# EAGLE design Bread (EAGLE 7.2.0)
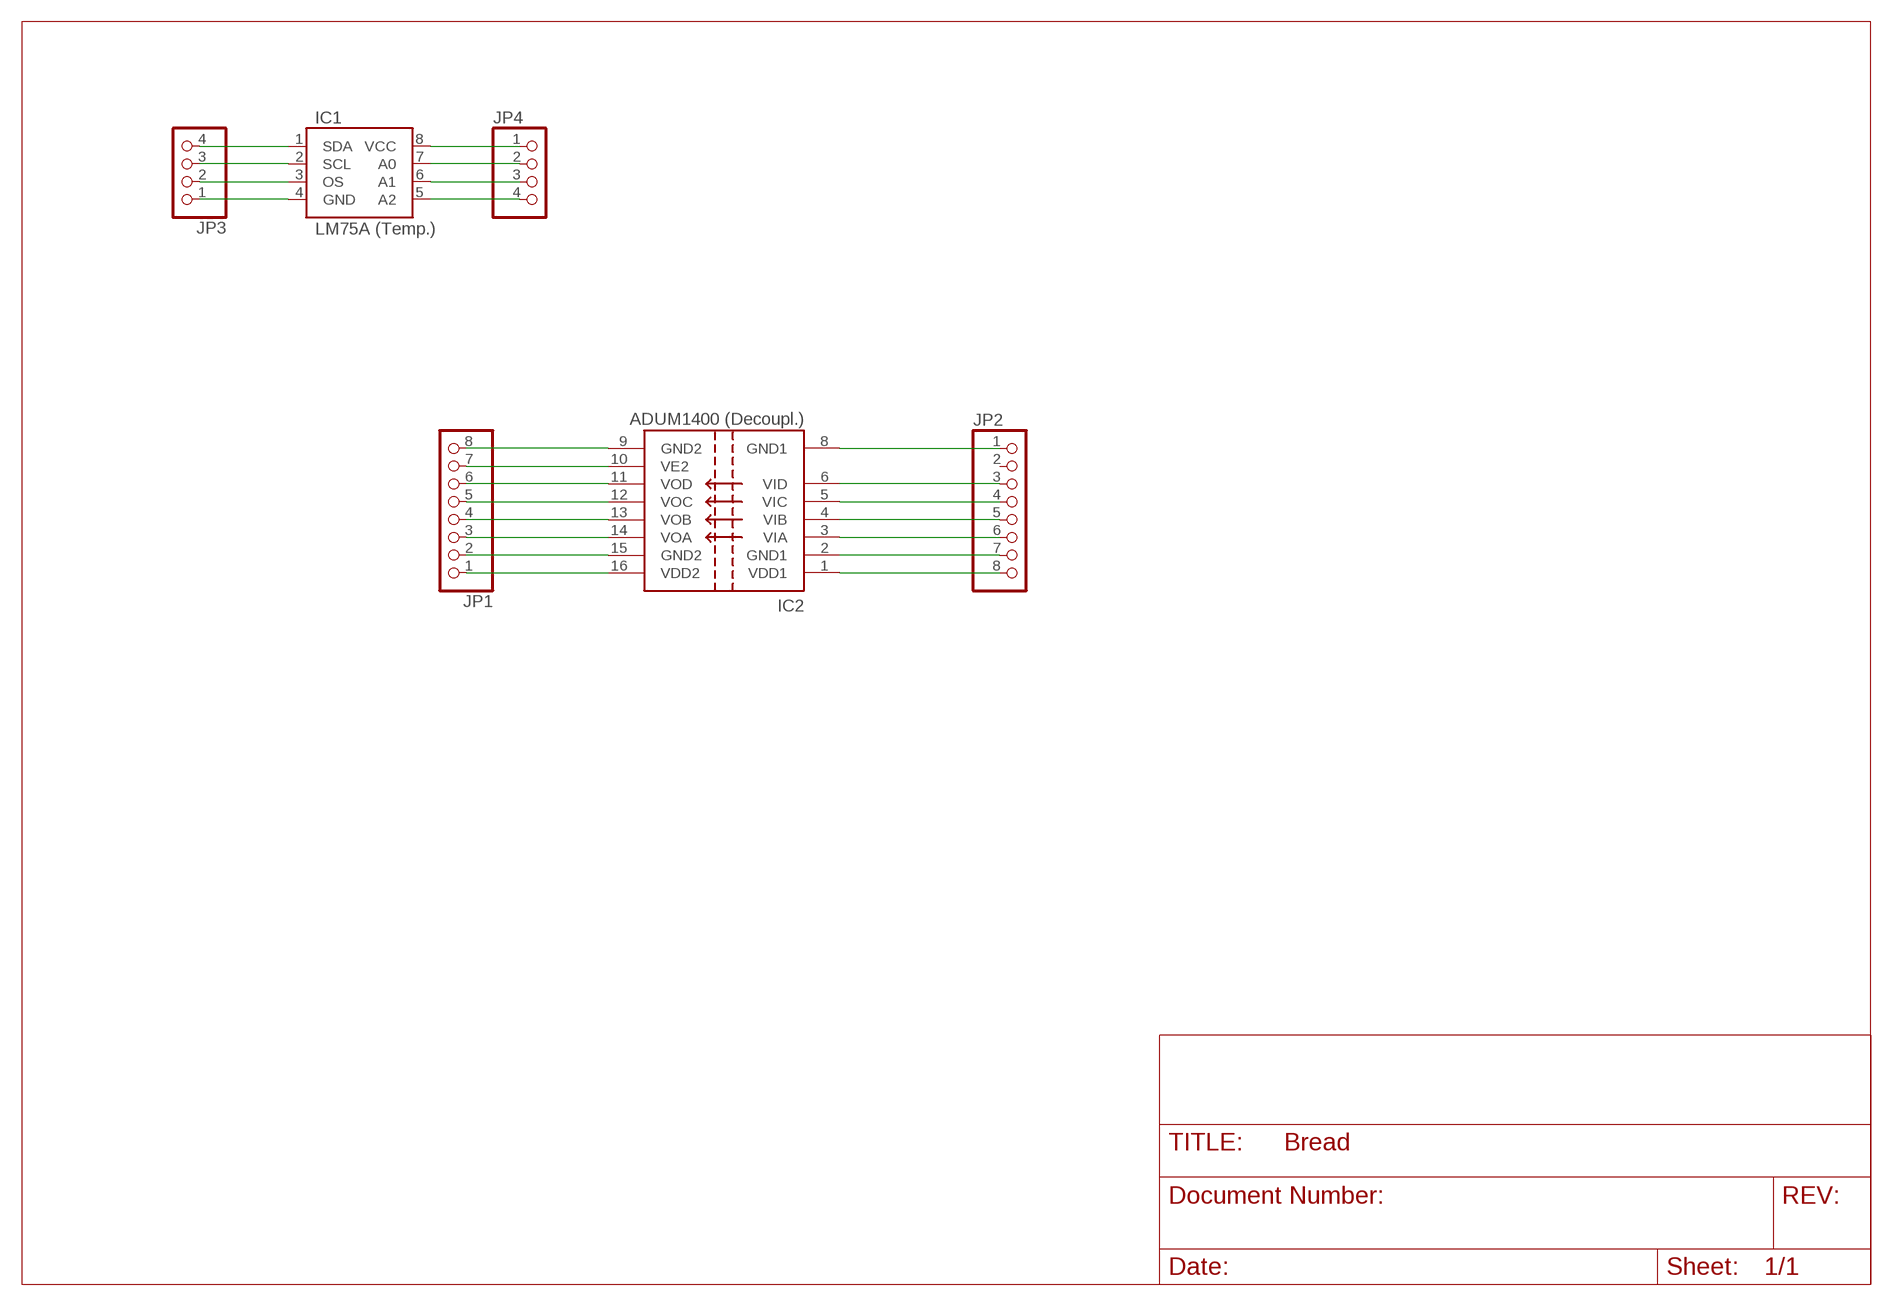
[diagram p0: schematic, sheet 1, part 1 of 2]
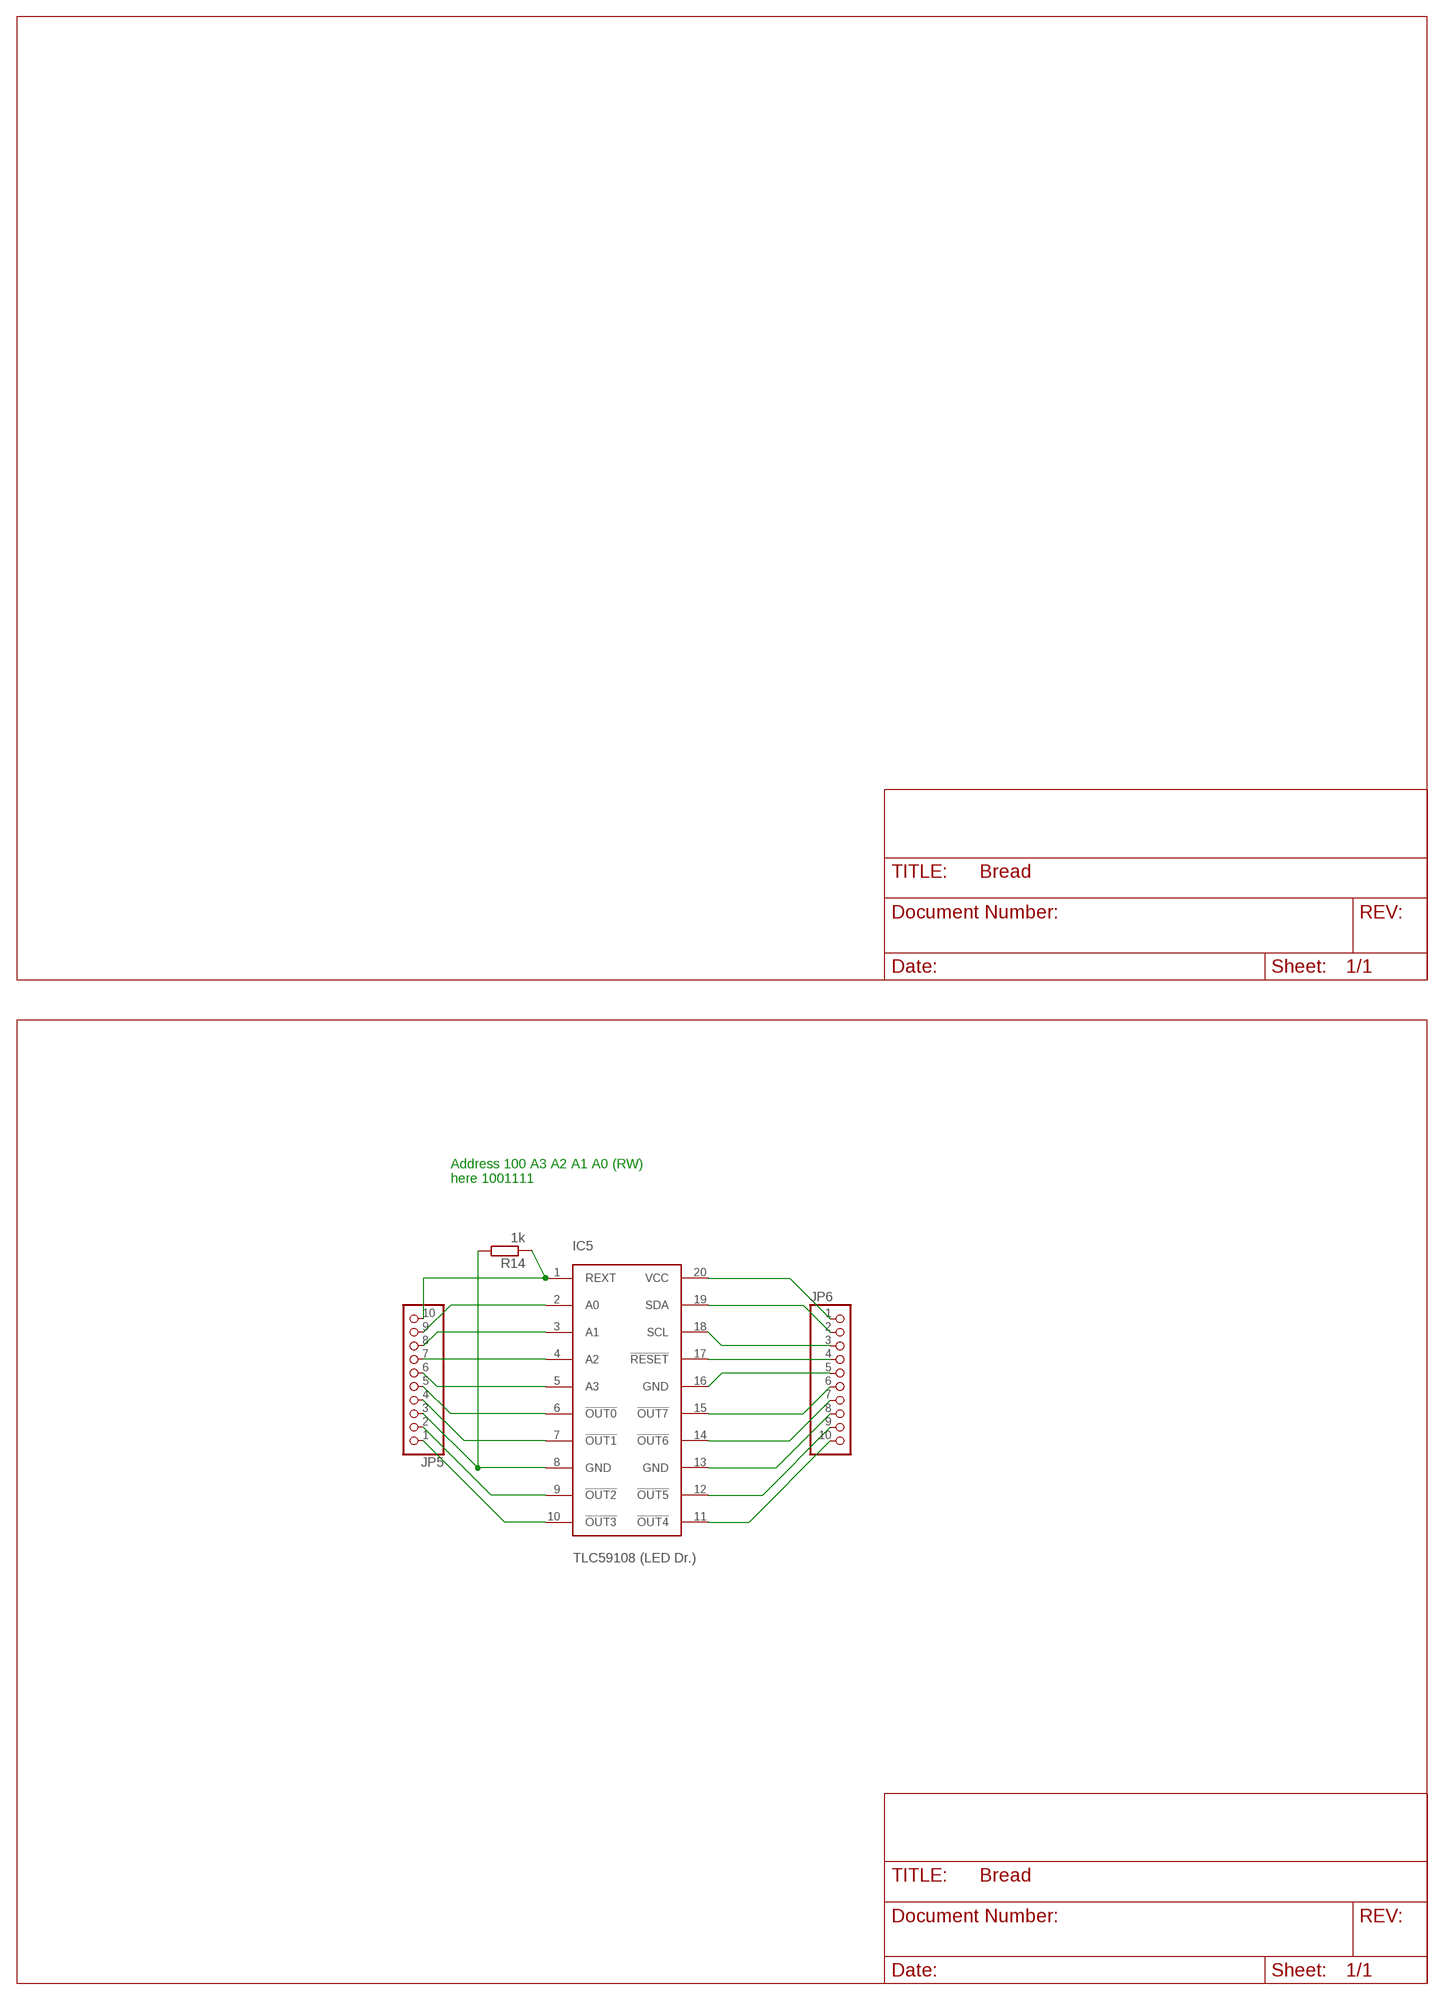
[diagram p1: schematic, sheet 1, part 2 of 2]

## Parts
IC1  LM75A (Temp.)  LM75A  [SO8]
IC2  ADUM1400 (Decoupl.)  ADUM1400  [SO16W]
IC5  TLC59108 (LED Dr.)  TLC59108  [TSSOP20]
JP1  PINHD-1X8_2.54  [1X08]
JP2  PINHD-1X8_2.54  [1X08]
JP3  PINHD-1X4_2.54  [1X04]
JP4  PINHD-1X4_2.54  [1X04]
JP5  PINHD-1X10_2.54  [1X10]
JP6  PINHD-1X10_2.54  [1X10]
R14  1k  R-EU_R0603  [R0603]

## Nets
GND1@1: IC2.2(GND1) JP2.7
GND1@2: IC2.8(GND1) JP2.1
GND2@1: IC2.15(GND2) JP1.2
GND2@2: IC2.9(GND2) JP1.8
N$1 [L]: IC5.1(REXT) JP5.10 R14.1
N$2: IC2.10(VE2) JP1.7
N$3: IC2.11(VOD) JP1.6
N$4: IC2.12(VOC) JP1.5
N$5: IC2.13(VOB) JP1.4
N$6 [L]: IC5.2(A0) JP5.9
N$7: IC2.14(VOA) JP1.3
N$8 [L]: IC5.3(A1) JP5.8
N$9: IC2.16(VDD2) JP1.1
N$10: IC2.6(VID) JP2.3
N$11: IC2.5(VIC) JP2.4
N$12 [L]: IC5.4(A2) JP5.7
N$13: IC2.4(VIB) JP2.5
N$14: IC2.3(VIA) JP2.6
N$15: IC2.1(VDD1) JP2.8
N$16: IC1.1(SDA) JP3.4
N$17: IC1.2(SCL) JP3.3
N$18: IC1.3(OS) JP3.2
N$19: IC1.4(GND) JP3.1
N$20: IC1.8(VCC) JP4.1
N$21: IC1.7(A0) JP4.2
N$22: IC1.6(A1) JP4.3
N$23: IC1.5(A2) JP4.4
N$24 [L]: IC5.5(A3) JP5.6
N$25 [L]: IC5.6(!OUT0) JP5.5
N$26 [L]: IC5.7(!OUT1) JP5.4
N$27 [L]: IC5.8(GND) JP5.3 R14.2
N$28 [L]: IC5.9(!OUT2) JP5.2
N$29 [L]: IC5.10(!OUT3) JP5.1
N$30 [L]: IC5.20(VCC) JP6.1
N$31 [L]: IC5.19(SDA) JP6.2
N$32 [L]: IC5.18(SCL) JP6.3
N$33 [L]: IC5.17(!RESET) JP6.4
N$34 [L]: IC5.16(GND) JP6.5
N$35 [L]: IC5.15(!OUT7) JP6.6
N$36 [L]: IC5.14(!OUT6) JP6.7
N$37 [L]: IC5.13(GND) JP6.8
N$38 [L]: IC5.12(!OUT5) JP6.9
N$39 [L]: IC5.11(!OUT4) JP6.10
Unconnected: JP2.2

## Notes on the sheet
- Address 100 A3 A2 A1 A0 (RW)
  here 1001111

## Library data of the parts
IC1 = philips-3:LM75A
IC2 = adum140x:ADUM1400
IC5 = TLC59108:TLC59108: 8-Bit Fast Mode Plus (FM+) I2C Bus Constant-Current LED Sink Driver
JP1 JP2 = pinhead-1:PINHD-1X8: PIN HEADER
JP3 JP4 = pinhead-1:PINHD-1X4: PIN HEADER
JP5 JP6 = pinhead-1:PINHD-1X10: PIN HEADER
R14 = rcl:R-EU_: RESISTOR, European symbol

## Net classes
0 default: width 0.508 mm
1 H: width 1.651 mm
2 M: width 1.016 mm
3 L: width 0.254 mm

## Board
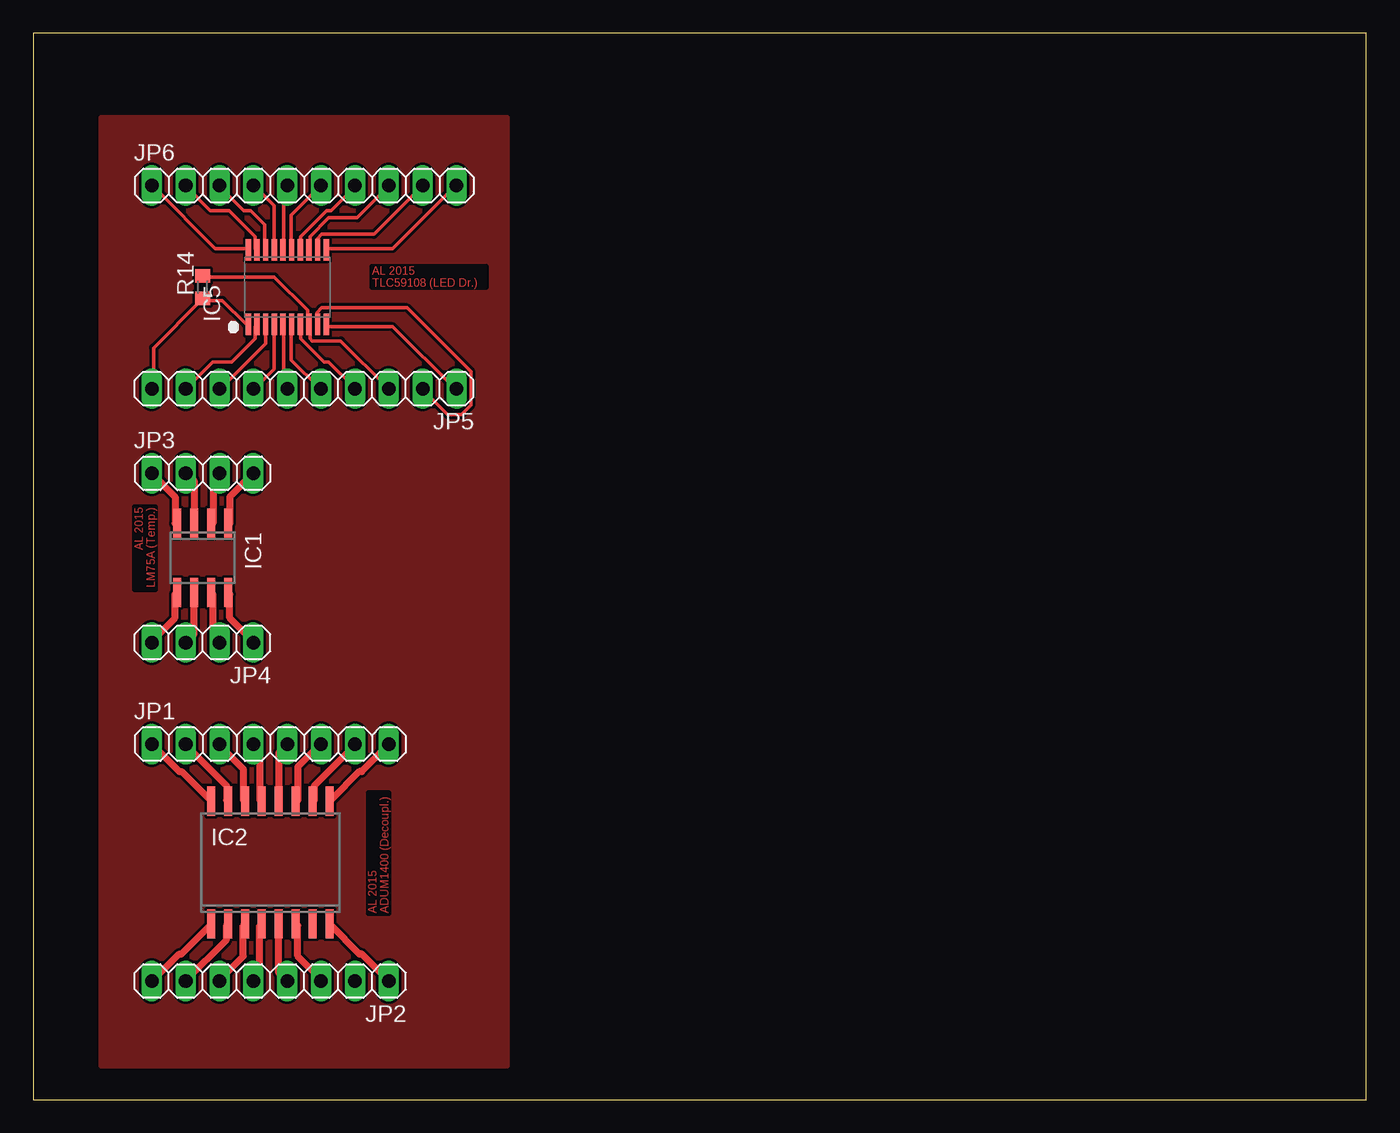
[diagram p2: board, top side]

Size 100 x 80 mm. Coordinates in mm from the lower left corner, seen from the top.
Outline: 0,0 100,0 100,80 0,80 0,0
Copper layers 1: Top 0.035mm
Design rules "default *": minimum track width 10mil, minimum drill 24mil, track to track 8mil, track to pad 8mil, pad to pad 8mil, via to via 8mil, smd to smd 8mil, copper to edge 40mil, drill to drill 8mil, minimum pad ring 10mil, minimum via ring 8mil, stop-mask expansion 4mil, vias tented up to drill 0mil, thermal gap 10mil

### Footprints (pad centres in the part's own frame; a part is rotated, then mirrored left to right if it is on the bottom)
SO8 = smd 0.6 x 2.2: 1 -1.905,-2.6; 2 -0.635,-2.6; 3 0.635,-2.6; 4 1.905,-2.6; 5 1.905,2.6; 6 0.635,2.6; 7 -0.635,2.6; 8 -1.905,2.6
SO16W = smd 0.6 x 2.2: 1 -4.445,-4.6; 2 -3.175,-4.6; 3 -1.905,-4.6; 4 -0.635,-4.6; 5 0.635,-4.6; 6 1.905,-4.6; 7 3.175,-4.6; 8 4.445,-4.6; 9 4.445,4.6; 10 3.175,4.6; 11 1.905,4.6; 12 0.635,4.6; 13 -0.635,4.6; 14 -1.905,4.6; 15 -3.175,4.6; 16 -4.445,4.6
TSSOP20 = smd 0.4 x 1.6: 1 -2.925,-2.8; 2 -2.275,-2.8; 3 -1.625,-2.8; 4 -0.975,-2.8; 5 -0.325,-2.8; 6 0.325,-2.8; 7 0.975,-2.8; 8 1.625,-2.8; 9 2.275,-2.8; 10 2.925,-2.8; 11 2.925,2.8; 12 2.275,2.8; 13 1.625,2.8; 14 0.975,2.8; 15 0.325,2.8; 16 -0.325,2.8; 17 -0.975,2.8; 18 -1.625,2.8; 19 -2.275,2.8; 20 -2.925,2.8
1X08 = drill 1.016 long: 1 -8.89,0; 2 -6.35,0; 3 -3.81,0; 4 -1.27,0; 5 1.27,0; 6 3.81,0; 7 6.35,0; 8 8.89,0
1X04 = drill 1.016 long: 1 -3.81,0; 2 -1.27,0; 3 1.27,0; 4 3.81,0
1X10 = drill 1.016 long: 1 -11.43,0; 2 -8.89,0; 3 -6.35,0; 4 -3.81,0; 5 -1.27,0; 6 1.27,0; 7 3.81,0; 8 6.35,0; 9 8.89,0; 10 11.43,0
R0603 = smd 1 x 1.1: 1 -0.85,0; 2 0.85,0

### Placement (x,y rotation side)
IC1  12.7,40.64 180 top
IC2  17.78,17.78 0 top
IC5  19.05,60.96 0 top
JP1  17.78,26.67 0 top
JP2  17.78,8.89 180 top
JP3  12.7,46.99 0 top
JP4  12.7,34.29 180 top
JP5  20.32,53.34 180 top
JP6  20.32,68.58 0 top
R14  12.7,60.96 90 top

### Tracks (layer width: path | path; a pad name or v marks a point on that pad's centre or on a via)
GND
  pour Top: 5.08,73.66 35.56,73.66 35.56,2.54 5.08,2.54
GND1@1
  Top 0.508: IC2.2 14.5,13.06 14.5,11.99 11.48,8.97 JP2.7
GND1@2
  Top 0.508: JP2.1 24.64,10.92 24.46,10.92 22.33,13.06 IC2.8
GND2@1
  Top 0.508: IC2.15 14.5,22.48 14.5,23.55 11.48,26.57 JP1.2
GND2@2
  Top 0.508: IC2.9 22.33,22.48 24.46,24.61 24.64,24.61 26.59,26.57 JP1.8
N$1
  Top 0.254: IC5.1 15.95,58.17 14.17,59.94 12.75,59.94 R14.1 12.57,59.94 9.02,56.39 9.02,53.37 JP5.10
N$2
  Top 0.508: IC2.10 21.08,22.48 21.08,23.55 24.11,26.57 JP1.7
N$3
  Top 0.508: IC2.11 19.84,22.48 19.84,24.97 21.44,26.57 JP1.6
N$4
  Top 0.508: IC2.12 18.41,26.04 JP1.5
N$5
  Top 0.508: IC2.13 16.99,22.48 16.99,26.21 16.64,26.57 JP1.4
N$6
  Top 0.254: IC5.2 16.66,57.99 16.66,57.1 14.88,55.32 13.46,55.32 11.51,53.37 JP5.9
N$7
  Top 0.508: IC2.14 15.75,22.48 15.75,24.79 13.97,26.57 JP1.3
N$8
  Top 0.254: IC5.3 17.42,58.14 17.42,56.72 14.05,53.34 JP5.8
N$9
  Top 0.508: JP1.1 10.95,24.61 11.12,24.61 13.26,22.48 IC2.16
N$10
  Top 0.508: IC2.6 19.84,13.06 19.84,10.74 21.61,8.97 JP2.3
N$11
  Top 0.508: IC2.5 18.41,9.5 18.95,8.97 JP2.4
N$12
  Top 0.254: IC5.4 18.09,57.99 18.09,54.79 16.66,53.37 JP5.7
N$13
  Top 0.508: IC2.4 16.99,13.06 16.99,9.32 16.64,8.97 JP2.5
N$14
  Top 0.508: IC2.3 15.75,13.06 15.75,10.74 13.97,8.97 JP2.6
N$15
  Top 0.508: IC2.1 13.26,13.06 11.12,10.92 10.95,10.92 8.99,8.97 JP2.8
N$16
  Top 0.508: JP3.4 14.73,45.21 14.73,43.26 IC1.1
N$17
  Top 0.508: IC1.2 13.49,43.26 13.49,46.63 13.84,46.99 JP3.3
N$18
  Top 0.508: IC1.3 12.06,46.46 11.53,46.99 JP3.2
N$19
  Top 0.508: IC1.4 10.64,43.26 10.64,45.21 8.87,46.99 JP3.1
N$20
  Top 0.508: IC1.8 14.73,37.92 14.73,36.14 16.51,34.37 JP4.1
N$21
  Top 0.508: IC1.7 13.49,37.92 13.49,34.72 13.84,34.37 JP4.2
N$22
  Top 0.508: IC1.6 12.06,34.9 11.53,34.37 JP4.3
N$23
  Top 0.508: IC1.5 10.64,37.92 10.64,36.14 8.87,34.37 JP4.4
N$24
  Top 0.254: IC5.5 18.8,57.99 18.8,53.54 18.97,53.37 JP5.6
N$25
  Top 0.254: IC5.6 19.33,57.99 19.33,55.5 21.46,53.37 JP5.5
N$26
  Top 0.254: IC5.7 20.04,57.99 20.04,57.1 21.82,55.32 22.17,55.32 24.13,53.37 JP5.4
N$27
  Top 0.254: R14.2 12.75,61.72 18.09,61.72 20.57,59.23 20.57,58.17 IC5.8 20.75,57.99 20.75,57.1 20.93,56.92 23.06,56.92 26.62,53.37 JP5.3
N$28
  Top 0.254: IC5.9 21.29,58.17 21.29,59.05 21.64,59.41 28.04,59.41 32.84,54.61 32.84,52.12 32.13,51.41 31.06,51.41 29.29,53.19 JP5.2
N$29
  Top 0.254: IC5.10 22,57.99 26.98,57.99 31.6,53.37 JP5.1
N$30
  Top 0.254: IC5.20 15.95,63.86 13.64,63.86 9.02,68.48 JP6.1
N$31
  Top 0.254: IC5.19 16.66,63.86 16.66,64.75 14.71,66.7 13.28,66.7 11.51,68.48 JP6.2
N$32
  Top 0.254: IC5.18 17.37,63.86 17.37,65.63 16.31,66.7 15.77,66.7 13.99,68.48 JP6.3
N$33
  Top 0.254: IC5.17 18.09,63.86 18.09,67.06 16.66,68.48 JP6.4
N$34
  Top 0.254: IC5.16 18.8,63.86 18.8,68.3 18.97,68.48 JP6.5
N$35
  Top 0.254: IC5.15 19.33,63.86 19.33,66.34 21.46,68.48 JP6.6
N$36
  Top 0.254: IC5.14 20.04,63.86 20.04,64.75 22,66.7 22.35,66.7 24.13,68.48 JP6.7
N$37
  Top 0.254: IC5.13 20.75,63.86 20.75,64.75 22.17,66.17 24.31,66.17 26.62,68.48 JP6.8
N$38
  Top 0.254: JP6.9 25.55,64.92 21.64,64.92 21.29,64.57 21.29,63.86 IC5.12
N$39
  Top 0.254: IC5.11 22,63.86 26.98,63.86 31.6,68.48 JP6.10

### Text on the board
Top: AL 2015 / TLC59108 (LED Dr.) | AL 2015 / LM75A (Temp.) | AL 2015 / ADUM1400 (Decoupl.)